# EAGLE schematic datalogger_v1 (EAGLE 7.2.0)
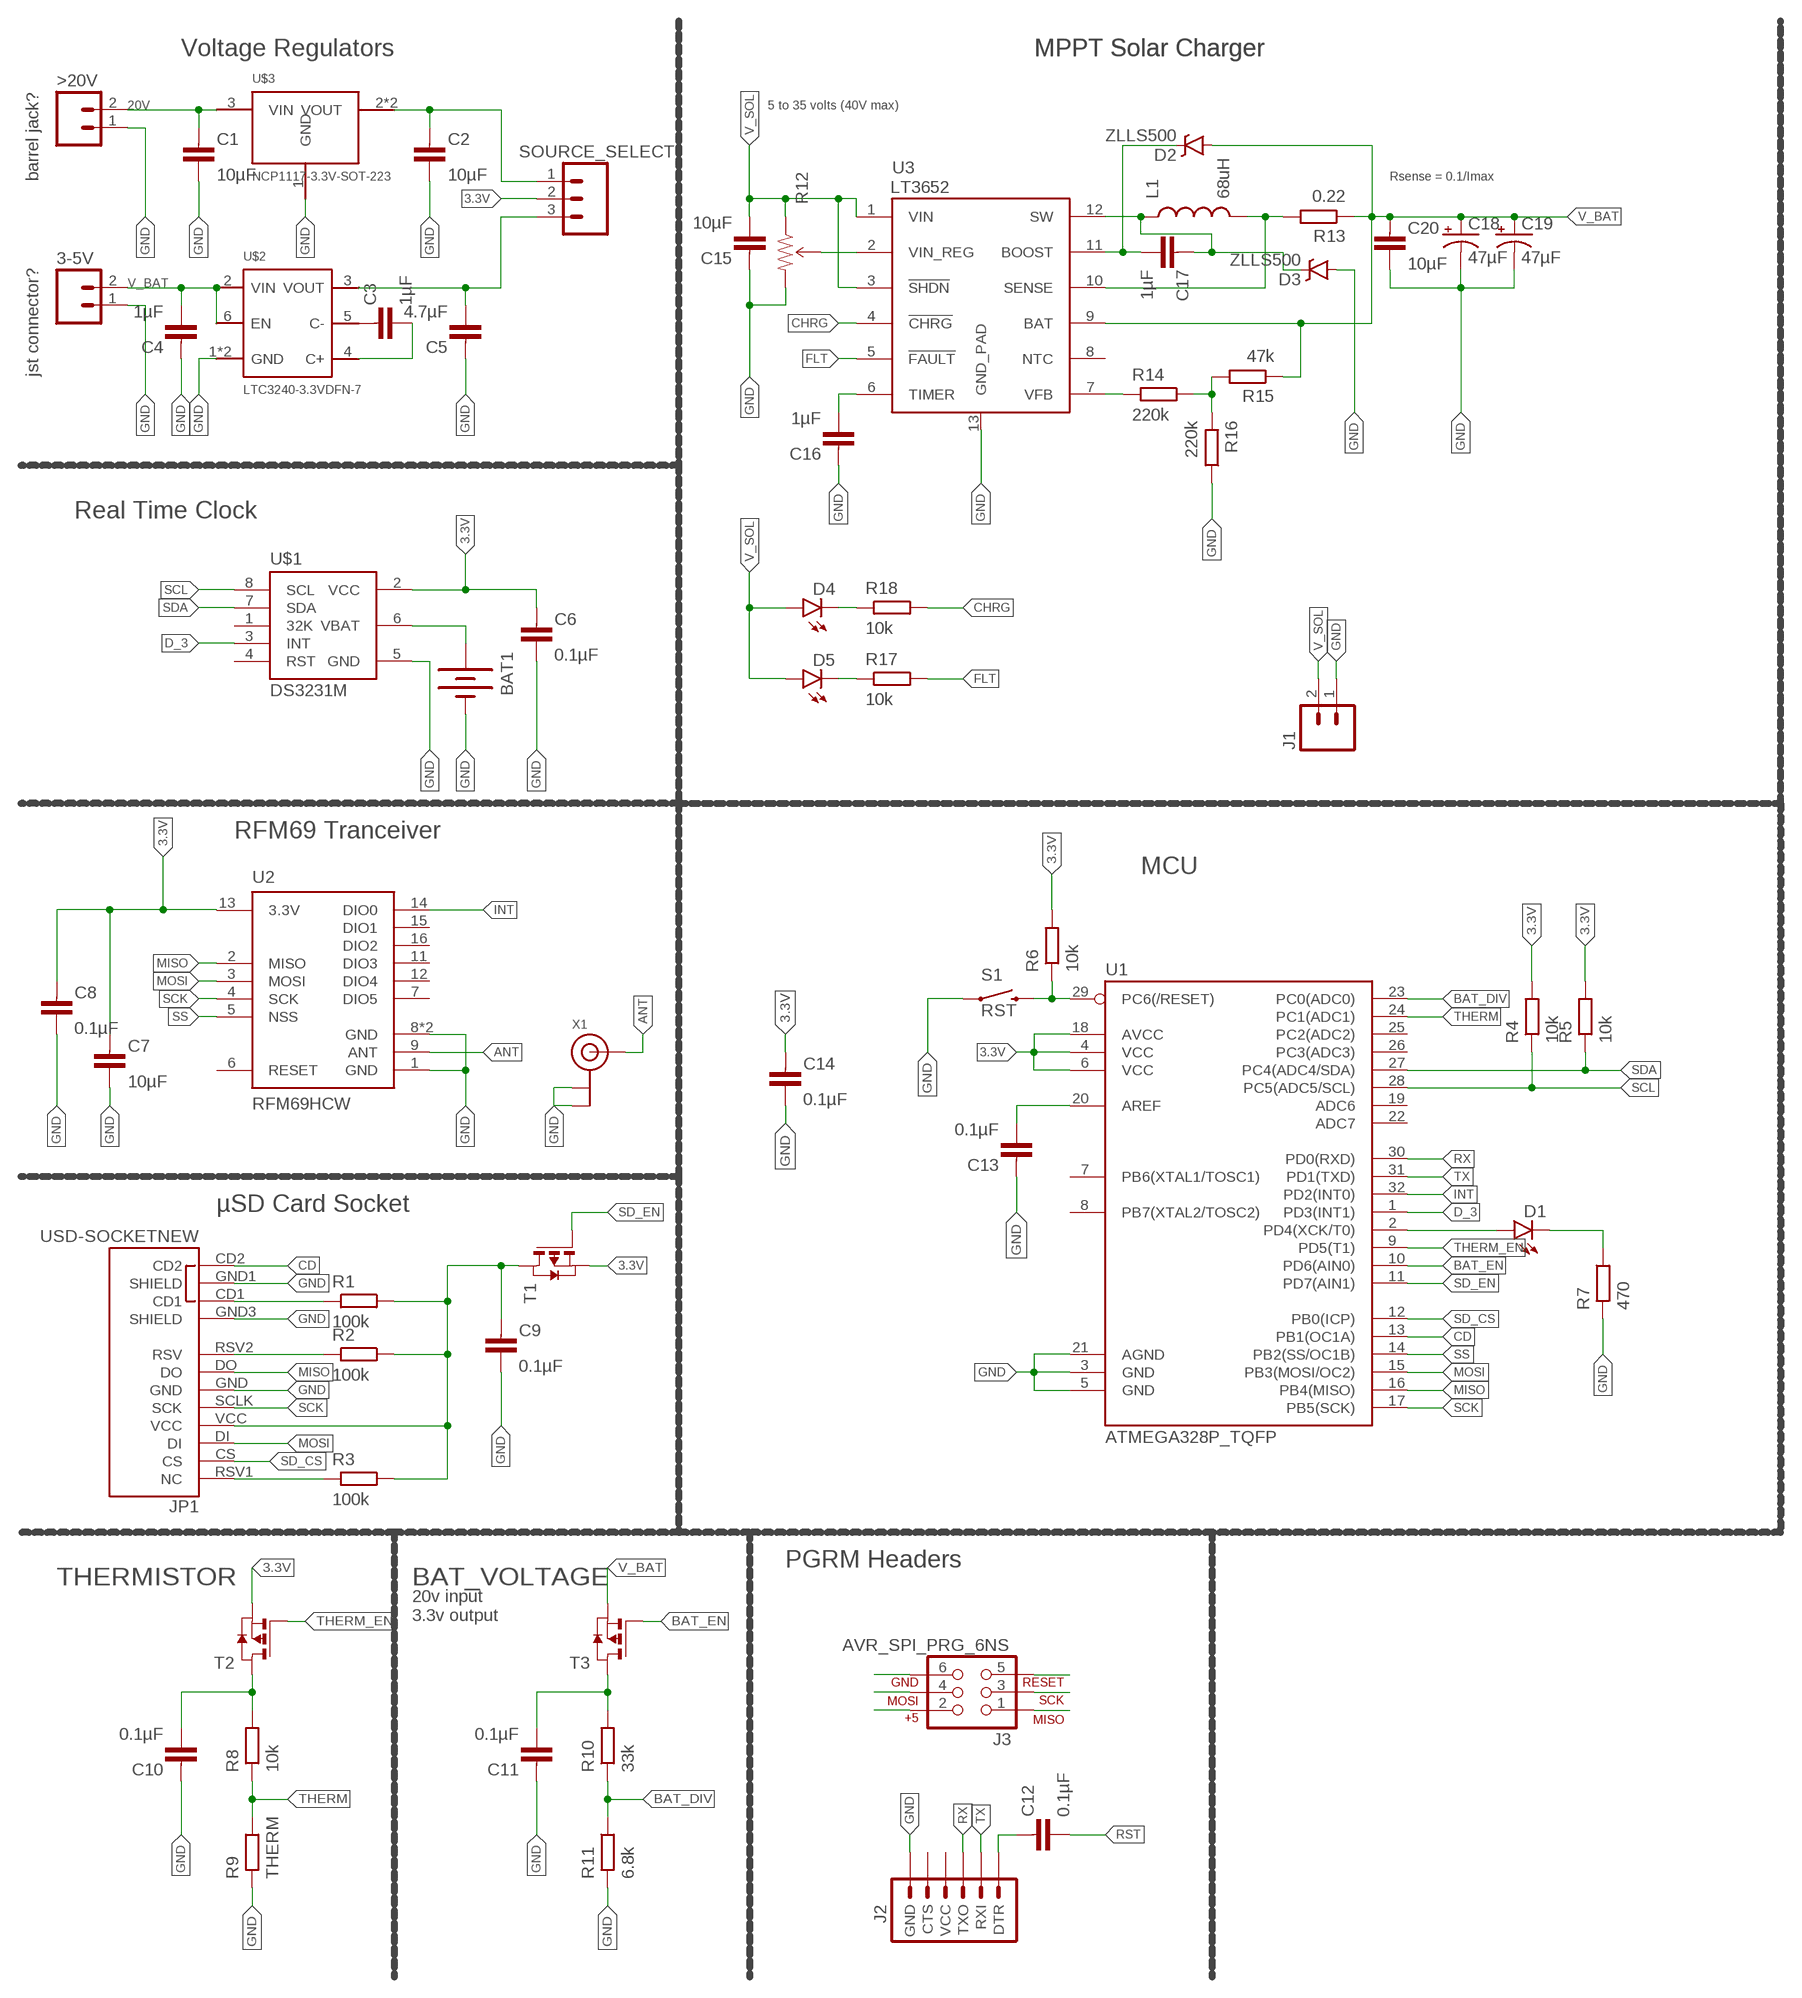
[diagram p0: schematic, sheet 1]

## Parts
3-5V  M02LOCK  [1X02_LOCK]
>20V  M02LOCK  [1X02_LOCK]
BAT1  BATTERY12MM  [BATTCON_12MM]
C1  10µF  CAPACITOR0805-N  [C0805-N]
C2  10µF  CAPACITOR0805-N  [C0805-N]
C3  1µF  CAPACITOR0603-N  [C0603-N]
C4  1µF  CAPACITOR0603-N  [C0603-N]
C5  4.7µF  CAPACITOR0603-N  [C0603-N]
C6  0.1µF  CAPACITOR0603-N  [C0603-N]
C7  10µF  CAPACITOR0805-N  [C0805-N]
C8  0.1µF  CAPACITOR0603-N  [C0603-N]
C9  0.1µF  CAPACITOR0603-N  [C0603-N]
C10  0.1µF  CAPACITOR0603-N  [C0603-N]
C11  0.1µF  CAPACITOR0603-N  [C0603-N]
C12  0.1µF  CAPACITOR0603-N  [C0603-N]
C13  0.1µF  CAPACITOR0603-N  [C0603-N]
C14  0.1µF  CAPACITOR0603-N  [C0603-N]
C15  10µF  CAPACITOR0805-N  [C0805-N]
C16  1µF  CAPACITOR0603-N  [C0603-N]
C17  1µF  CAPACITOR0603-N  [C0603-N]
C18  47µF  CAP_POLEN_J2  [EN_J2]
C19  47µF  CAP_POLEN_J2  [EN_J2]
C20  10µF  CAPACITOR0805-N  [C0805-N]
D1  LED0603  [LED-0603]
D2  ZLLS500  ZLLS500ZLLS500  [SOT23-3]
D3  ZLLS500  ZLLS500ZLLS500  [SOT23-3]
D4  LED0603  [LED-0603]
D5  LED0603  [LED-0603]
J1  M02LOCK  [1X02_LOCK]
J2  ARDUINO_SERIAL_PROGRAMLOCK  [1X06_LOCK]
J3  AVR_SPI_PRG_6NS  [2X3-NS]
JP1  USD-SOCKETNEW  [MICRO-SD-SOCKET-PP]
L1  68uH  INDUCTOR68UH-1A  [CR75]
R1  100k  RESISTOR0603-N  [R0603-N]
R2  100k  RESISTOR0603-N  [R0603-N]
R3  100k  RESISTOR0603-N  [R0603-N]
R4  10k  RESISTOR0603-N  [R0603-N]
R5  10k  RESISTOR0603-N  [R0603-N]
R6  10k  RESISTOR0603-N  [R0603-N]
R7  470  RESISTOR0603-N  [R0603-N]
R8  10k  RESISTOR0603-N  [R0603-N]
R9  THERM  RESISTOR0603-N  [R0603-N]
R10  33k  RESISTOR0603-N  [R0603-N]
R11  6.8k  RESISTOR0603-N  [R0603-N]
R12  TRIMPOT  [TRIMPOT-5MM-V2]
R13  0.22  RESISTOR0603-N  [R0603-N]
R14  220k  RESISTOR0603-N  [R0603-N]
R15  47k  RESISTOR0603-N  [R0603-N]
R16  220k  RESISTOR0603-N  [R0603-N]
R17  10k  RESISTOR0603-N  [R0603-N]
R18  10k  RESISTOR0603-N  [R0603-N]
S1  RST  SWITCH-MOMENTARY-2SMD-4.6X2.8MM  [TACTILE_SWITCH_SMD_4.6X2.8MM]
SOURCE_SELECT  M03LOCK  [1X03_LOCK]
T1  PMOSSOT23  [SOT-23]
T2  PMOSSOT23  [SOT-23]
T3  PMOSSOT23  [SOT-23]
U1  ATMEGA328P_TQFP  [TQFP32-08]
U2  RFM69HCW  [RFM69HCW-XXXS2]
U3  LT3652  [MSOP-12_GND]
U$1  DS3231M  [SO08]
U$2  LTC3240-3.3VDFN-7  [DFN200X200X80-7N]
U$3  NCP1117-3.3V-SOT-223  [SOT223]
X1  ADAFRUIT_ANTENNA_U.FL  [ADAFRUIT_U.FL]

## Nets
3.3V: C6.1 C7.1 C8.1 C14.1 J3.2 R4.2 R5.2 R6.2 SOURCE_SELECT.2 T1.2(S) T2.2(S) U1.4(VCC) U1.6(VCC) U1.18(AVCC) U2.13(3.3V) U$1.2(VCC)
20V: >20V.2 C1.1 U$3.3(VIN)
ANT: U2.9(ANT) X1.3(SIGNAL)
BAT_DIV: R10.1 R11.2 U1.23(PC0(ADC0))
BAT_EN: T3.3(G) U1.10(PD6(AIN0))
CD: JP1.CD2 U1.13(PB1(OC1A))
CHRG: R18.2 U3.4(!CHRG)
D_3: U1.1(PD3(INT1)) U$1.3(INT)
FLT: R17.2 U3.5(!FAULT)
GND: 3-5V.1 >20V.1 BAT1.GND(-) C1.2 C2.2 C4.1 C5.1 C6.2 C7.2 C8.2 C9.2 C10.1 C11.1 C13.1 C14.2 C15.1 C16.1 C18.- C19.- C20.2 D3.1(A) J1.1 J2.6(GND) J3.6 JP1.GND JP1.GND1(SHIELD) JP1.GND3(SHIELD) R7.1 R9.1 R11.1 R12.C(CW) R16.2 S1.1 S1.2 U1.3(GND) U1.5(GND) U1.21(AGND) U2.1(GND) U2.8(GND) U2.10(GND) U3.13(GND_PAD) U$1.5(GND) U$2.1(GND) U$2.7(GND) U$3.1(GND) X1.1(GND) X1.2(GND)
INT: U1.32(PD2(INT0)) U2.14(DIO0)
MISO: J3.1 JP1.DO U1.16(PB4(MISO)) U2.2(MISO)
MOSI: J3.4 JP1.DI U1.15(PB3(MOSI/OC2)) U2.3(MOSI)
N$1: BAT1.PWR@1(+) U$1.6(VBAT)
N$2: C12.1 J2.1(DTR)
N$3: C2.1 SOURCE_SELECT.1 U$3.2(VOUT) U$3.4(VOUT)
N$4: C11.2 R10.2 T3.1(D)
N$5: JP1.CD1 R1.1
N$7: JP1.RSV2(RSV) R2.1
N$8: C17.1 D3.3(C) L1.P$1 U3.12(SW)
N$9: C10.2 R8.2 T2.1(D)
N$10: C3.1 U$2.5(C-)
N$11: C3.2 U$2.4(C+)
N$12: C13.2 U1.20(AREF)
N$13: L1.P$2 R13.2 U3.10(SENSE)
N$14: C5.2 SOURCE_SELECT.3 U$2.3(VOUT)
N$15: R12.B(WIPER) U3.2(VIN_REG)
N$17: JP1.RSV1(NC) R3.1
N$18: C16.2 U3.6(TIMER)
N$21: D1.A U1.2(PD4(XCK/T0))
N$22: C17.2 D2.3(C) U3.11(BOOST)
N$23: R14.1 U3.7(VFB)
N$24: R14.2 R15.2 R16.1
N$26: D1.C R7.2
N$29: D4.C R18.1
N$30: D5.C R17.1
N$33: C9.1 JP1.VCC R1.2 R2.2 R3.2 T1.1(D)
RST: C12.2 J3.5 R6.1 S1.3 S1.4 U1.29(PC6(/RESET))
RX: J2.3(TXO) U1.30(PD0(RXD))
SCK: J3.3 JP1.SCLK(SCK) U1.17(PB5(SCK)) U2.4(SCK)
SCL: R4.1 U1.28(PC5(ADC5/SCL)) U$1.8(SCL)
SD_CS: JP1.CS U1.12(PB0(ICP))
SD_EN: T1.3(G) U1.11(PD7(AIN1))
SDA: R5.1 U1.27(PC4(ADC4/SDA)) U$1.7(SDA)
SS: U1.14(PB2(SS/OC1B)) U2.5(NSS)
THERM: R8.1 R9.2 U1.24(PC1(ADC1))
THERM_EN: T2.3(G) U1.9(PD5(T1))
TX: J2.2(RXI) U1.31(PD1(TXD))
V_BAT: 3-5V.2 C4.2 C18.+ C19.+ C20.1 D2.1(A) R13.1 R15.1 T3.2(S) U3.9(BAT) U$2.2(VIN) U$2.6(EN)
V_SOL: C15.2 D4.A D5.A J1.2 R12.A(CCW) U3.1(VIN) U3.3(!SHDN)
Unconnected: J2.4(VCC) J2.5(CTS) U1.7(PB6(XTAL1/TOSC1)) U1.8(PB7(XTAL2/TOSC2)) U1.19(ADC6) U1.22(ADC7) U1.25(PC2(ADC2)) U1.26(PC3(ADC3)) U2.6(RESET) U2.7(DIO5) U2.11(DIO3) U2.12(DIO4) U2.15(DIO1) U2.16(DIO2) U3.8(NTC) U$1.1(32K) U$1.4(RST)

## Notes on the sheet
- Voltage Regulators | MPPT Solar Charger | MPPT Solar Charger
- 5 to 35 volts (40V max)
- barrel jack? | Rsense = 0.1/Imax
- jst connector?
- Real Time Clock
- RFM69 Tranceiver
- MCU
- µSD Card Socket
- PGRM Headers
- THERMISTOR | BAT_VOLTAGE
- 20v input 
  3.3v output

## Library data of the parts
3-5V >20V J1 = SparkFun-Connectors:M02: Standard 2-pin 0.1" header. Use with - straight break away headers ( PRT-00116) - right angle break away headers (PRT-00553) - swiss pins (PRT-00743) - machine pins (PRT-00117) - female headers (PRT-00115) Molex polarized connector foot print use with: PRT-08233 with associated crimp pins and housings. 2.54_SCREWTERM for use with PRT-10571. 3.5mm Screw Terminal footprints for PRT-08084 5mm Screw Terminal footprints for use with PRT-08432
BAT1 = riffle-beta-0.1.8:BATTERY: Battery Holders Various common sizes : AA, AAA, 20mm coin cell and 12mm coin cell.
C1-C17 C20 = passives-7351:CAPACITOR
C18 C19 = SparkFun-Capacitors:CAP_POL: Capacitor Polarized These are standard SMD and PTH capacitors. Normally 10uF, 47uF, and 100uF in electrolytic and tantalum varieties. Always verify the external diameter of the through hole cap, it varies with capacity, voltage, and manufacturer. The EIA devices should be standard.
D1 D4 D5 = SparkFun-LED:LED: LEDs Standard schematic elements and footprints for 5mm, 3mm, 1206, and 0603 sized LEDs. 5mm - Spark Fun Electronics SKU : COM-00529 (and others)
D2 D3 = SparkFun-DiscreteSemi:ZLLS500: 700mA 40V SOT-23 Schottky; PROD_ID: DIO-08411
J2 = SparkFun-Connectors:ARDUINO_SERIAL_PROGRAM: FTDI connector footprints
J3 = SparkFun-Connectors:AVR_SPI_PRG_6: AVR ISP 6 Pin This is the reduced ISP connector for AVR programming. Common on Arduino. This footprint will take up less PCB space and can be used with a 10-pin to 6-pin adapter such as SKU: BOB-08508 **Special note about "TEST_POINT" package. The stop mask is on the top side, so if you want your programming test points to be on the bottom of your board, make sure to place this package on the bottom side of the board. This also ensure that the orientation to program from the bottom side will be correct.
JP1 = SparkFun-Connectors:USD-SOCKET: microSD Socket Push-push type uSD socket. Schematic element and footprint production proven. Spark Fun Electronics SKU : PRT-00127. tDoc lines correctly indicate media card edge positions when inserting (unlocked, locked, depressed). NOTE: CD1 and CD2 are connected internally; PROD_ID: CONN-07820
L1 = SparkFun-Passives:INDUCTOR: Inductors Basic Inductor/Choke - 0603 and 1206. Footprints are not proven and vary greatly between part numbers. INDUCTOR POWER 3.3UH 4.0A SMD 0.197" L x 0.197" W x 0.177" H (5.00mm x 5.00mm x 4.50mm); PROD_ID: NDUC-09739
R1-R11 R13-R18 = passives-7351:RESISTOR
R12 = SparkFun-Electromechanical:TRIMPOT: Various small potentiometers for "set-and-forget" applications
S1 = SparkFun-Electromechanical:SWITCH-MOMENTARY-2: Various NO switches- pushbuttons, reed, etc; PROD_ID: SWCH-13065
SOURCE_SELECT = SparkFun-Connectors:M03: Header 3 Standard 3-pin 0.1" header. Use with straight break away headers (SKU : PRT-00116), right angle break away headers (PRT-00553), swiss pins (PRT-00743), machine pins (PRT-00117), and female headers (PRT-00115). Molex polarized connector foot print use with SKU : PRT-08232 with associated crimp pins and housings.
T1-T3 = riffle-beta-0.1.8:PMOSSOT23: MOS FET; OC_FARNELL: unknown; OC_NEWARK: unknown
U1 = SparkFun-DigitalIC:ATMEGA328P_TQFP; PROD_ID: IC-09069
U2 = SparkFun-RF:RFM69H; PROD_ID: IC-11997, IC-12053
U3 = SparkFun-PowerIC:LT3652: LT3652 MPPT Solar Charge Controller 5V-32V smart charger for batteries up to 14.4V
U$1 = _my-parts:DS3231M: The DS3231M is a low-cost, extremely accurate, I2C realtime clock (RTC). Datasheet <https://datasheets.maximintegrated.com/en/ds/DS3231M.pdf>
U$2 = _my-parts:LTC3240-3.3V
U$3 = _my-parts:NCP1117-3.3V
X1 = MoteinoMEGA:ADAFRUIT_ANTENNA_U.FL: U.FL Antenna Connector